# EAGLE schematic Project-PowerSwitch001 (EAGLE 7.2.0)

## Sheet 1 of 3
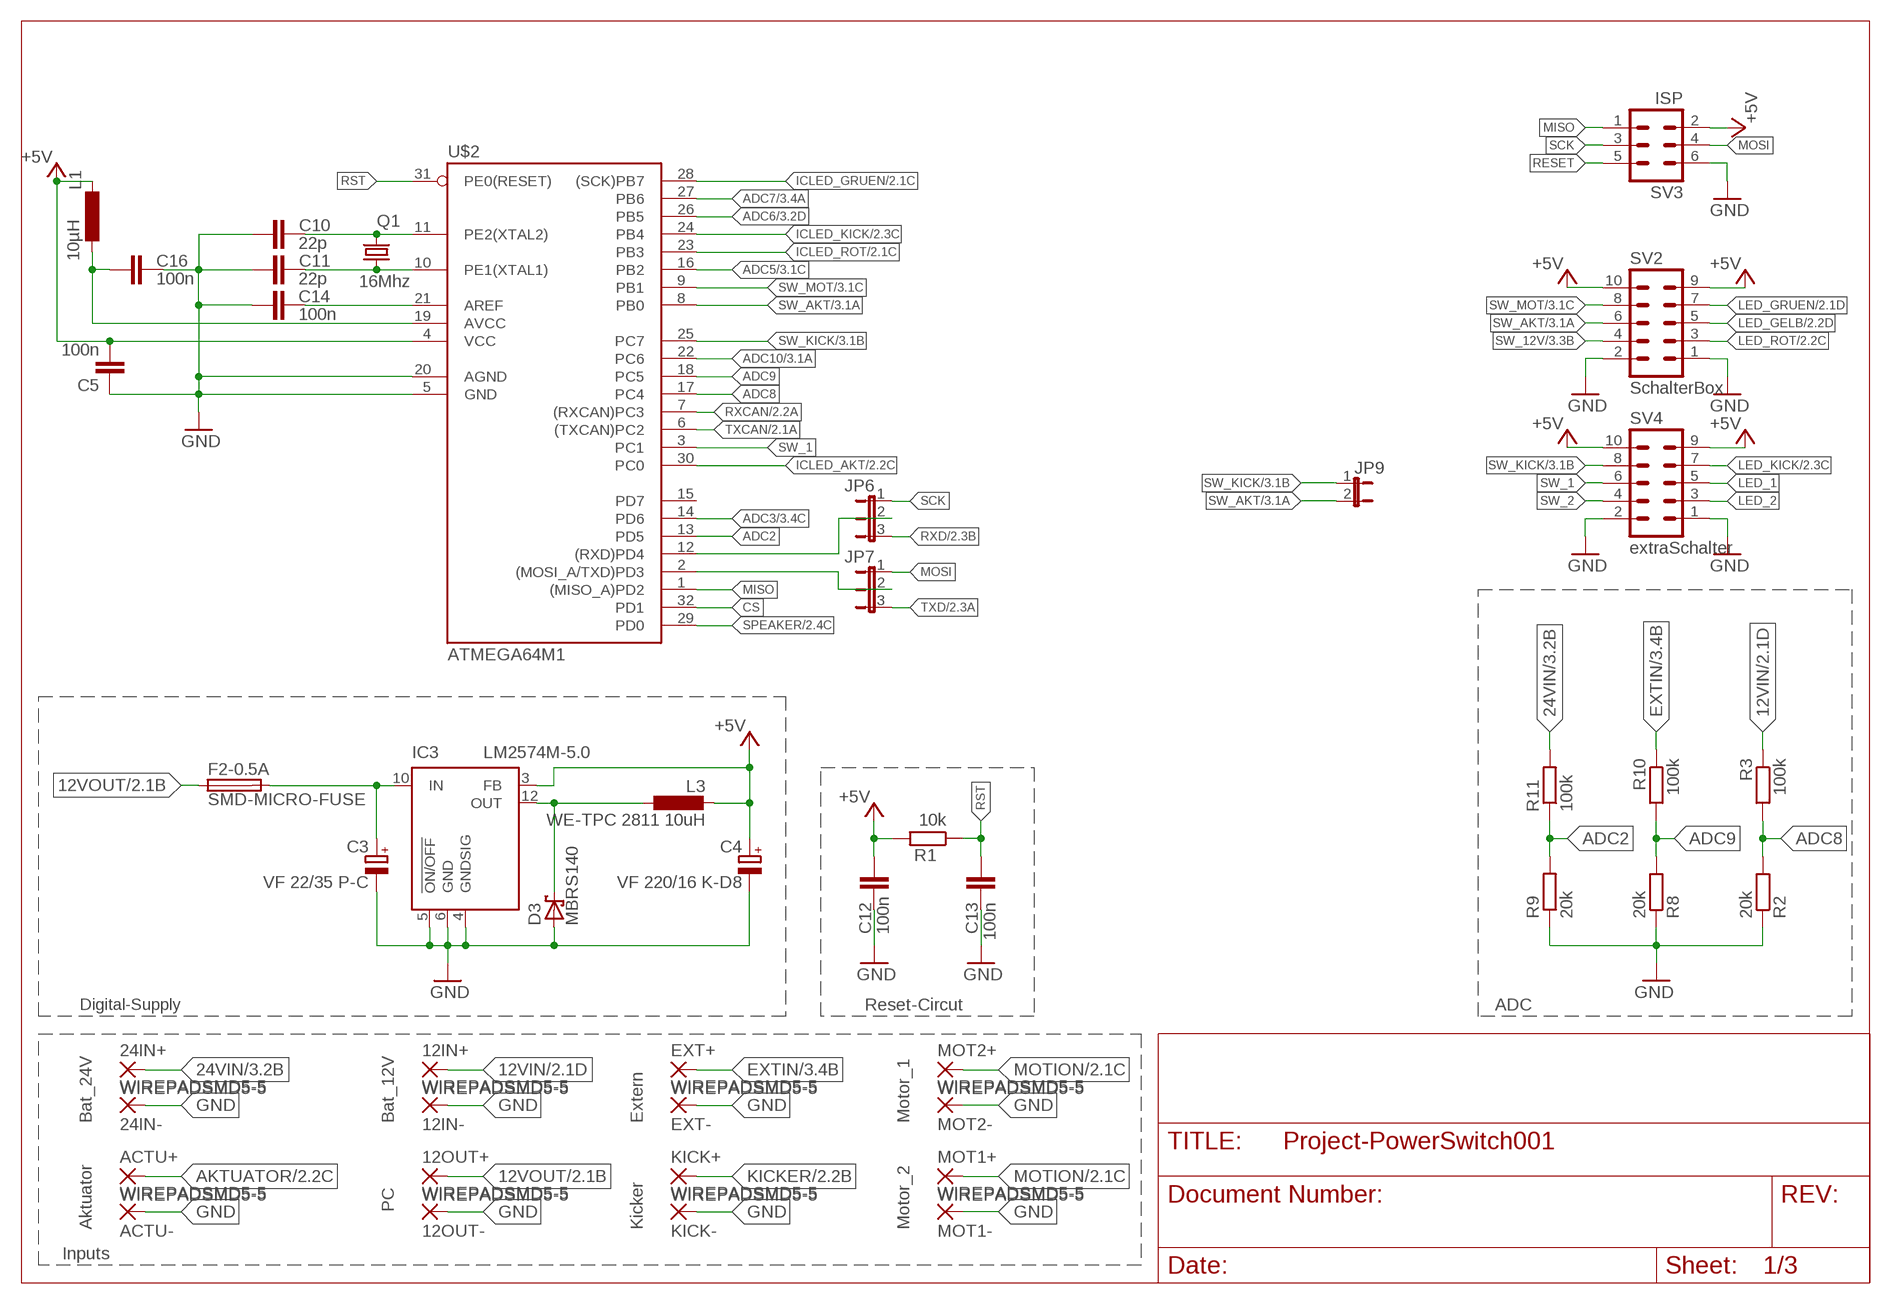
[diagram p0: schematic, sheet 1]

### Parts
12IN+  WIREPADSMD5-5  [5-5]
12IN-  WIREPADSMD5-5  [5-5]
12OUT+  WIREPADSMD5-5  [5-5]
12OUT-  WIREPADSMD5-5  [5-5]
24IN+  WIREPADSMD5-5  [5-5]
24IN-  WIREPADSMD5-5  [5-5]
ACTU+  WIREPADSMD5-5  [5-5]
ACTU-  WIREPADSMD5-5  [5-5]
C3  VF 22/35 P-C  CPOL-EUC  [PANASONIC_C]
C4  VF 220/16 K-D8  CPOL-EUD  [PANASONIC_D]
C5  100n  C-EUC0603K  [C0603K]
C10  22p  C-EUC0603K  [C0603K]
C11  22p  C-EUC0603K  [C0603K]
C12  100n  C-EUC0603K  [C0603K]
C13  100n  C-EUC0603K  [C0603K]
C14  100n  C-EUC0603K  [C0603K]
C16  100n  C-EUC0603K  [C0603K]
D3  MBRS140  SCHOTTKY-DIODESMD  [SMB]
EXT+  WIREPADSMD5-5  [5-5]
EXT-  WIREPADSMD5-5  [5-5]
F2-0.5A  SMD-MICRO-FUSE  [SMD-6,1X2,6]
IC3  LM2574M-5.0  [SO14W]
JP6  JP2E  [JP2]
JP7  JP2E  [JP2]
JP9  JP1E  [JP1]
KICK+  WIREPADSMD5-5  [5-5]
KICK-  WIREPADSMD5-5  [5-5]
L1  10µH  L-EU-0805L0805  [R0805]
L3  WE-TPC 2811 10uH  L-EUWE-TPC  [POWER-CHOKE_WE-TPC]
MOT1+  WIREPADSMD5-5  [5-5]
MOT1-  WIREPADSMD5-5  [5-5]
MOT2+  WIREPADSMD5-5  [5-5]
MOT2-  WIREPADSMD5-5  [5-5]
Q1  16Mhz  CRYTALHC49U-V  [HC49U-V@1]
R1  10k  R-EU_R0805  [R0805]
R2  20k  R-EU_R0805  [R0805]
R3  100k  R-EU_R0805  [R0805]
R8  20k  R-EU_R0805  [R0805]
R9  20k  R-EU_R0805  [R0805]
R10  100k  R-EU_R0805  [R0805]
R11  100k  R-EU_R0805  [R0805]
SV2  SchalterBox  ML10  [ML10]
SV3  ISP  ML6  [ML6]
SV4  extraSchalter  ML10  [ML10]
U$2  ATMEGA64M1  [TQFP32-08]

### Nets
12VIN: 12IN+.P$1(P) R3.1 ; also sheet 2,3
12VOUT: 12OUT+.P$1(P) F2-0.5A.1 ; also sheet 2,3
24VIN: 24IN+.P$1(P) R11.2 ; also sheet 3
+5V: C4.+ C5.2 C12.2 IC3.3(FB) L1.2 L3.2 R1.2 SV2.9 SV2.10 SV3.2 SV4.9 SV4.10 U$2.4(VCC) ; also sheet 2
ADC2: R9.2 R11.1 U$2.13(PD5)
ADC3: U$2.14(PD6) ; also sheet 3
ADC5: U$2.16(PB2) ; also sheet 3
ADC6: U$2.26(PB5) ; also sheet 3
ADC7: U$2.27(PB6) ; also sheet 3
ADC8: R2.2 R3.2 U$2.17(PC4)
ADC9: R8.2 R10.2 U$2.18(PC5)
ADC10: U$2.22(PC6) ; also sheet 3
AKTUATOR: ACTU+.P$1(P) ; also sheet 2,3
CS: U$2.32(PD1)
EXTIN: EXT+.P$1(P) R10.1 ; also sheet 3
GND: 12IN-.P$1(P) 12OUT-.P$1(P) 24IN-.P$1(P) ACTU-.P$1(P) C3.- C4.- C5.1 C10.1 C11.1 C12.1 C13.1 C14.1 C16.2 D3.A EXT-.P$1(P) IC3.4(GNDSIG) IC3.5(!ON/OFF) IC3.6(GND) KICK-.P$1(P) MOT1-.P$1(P) MOT2-.P$1(P) R2.1 R8.1 R9.1 SV2.1 SV2.2 SV3.6 SV4.1 SV4.2 U$2.5(GND) U$2.20(AGND) ; also sheet 2,3
ICLED_AKT: U$2.30(PC0) ; also sheet 2
ICLED_GRUEN: U$2.28((SCK)PB7) ; also sheet 2
ICLED_KICK: U$2.24(PB4) ; also sheet 2
ICLED_ROT: U$2.23(PB3) ; also sheet 2
KICKER: KICK+.P$1(P) ; also sheet 2,3
LED_1: SV4.5
LED_2: SV4.3
LED_GELB: SV2.5 ; also sheet 2
LED_GRUEN: SV2.7 ; also sheet 2
LED_KICK: SV4.7 ; also sheet 2
LED_ROT: SV2.3 ; also sheet 2
MISO: SV3.1 U$2.1((MISO_A)PD2)
MOSI: JP7.1 SV3.4
MOTION: MOT1+.P$1(P) MOT2+.P$1(P) ; also sheet 2,3
N$10: C10.2 Q1.2 U$2.11(PE2(XTAL2))
N$11: C11.2 Q1.1 U$2.10(PE1(XTAL1))
N$13: C14.2 U$2.21(AREF)
N$14: C16.1 L1.1 U$2.19(AVCC)
N$16: JP6.2 U$2.12((RXD)PD4)
N$17: JP7.2 U$2.2((MOSI_A/TXD)PD3)
N$22: C3.+ F2-0.5A.2 IC3.10(IN)
N$64: D3.C IC3.12(OUT) L3.1
RESET: SV3.5
RST: C13.2 R1.1 U$2.31(PE0(RESET))
RXCAN: U$2.7((RXCAN)PC3) ; also sheet 2
RXD: JP6.3 ; also sheet 2
SCK: JP6.1 SV3.3
SPEAKER: U$2.29(PD0) ; also sheet 2
SW_1: SV4.6 U$2.3(PC1)
SW_2: SV4.4
SW_12V: SV2.4 ; also sheet 3
SW_AKT: JP9.2 SV2.6 U$2.8(PB0) ; also sheet 3
SW_KICK: JP9.1 SV4.8 U$2.25(PC7) ; also sheet 3
SW_MOT: SV2.8 U$2.9(PB1) ; also sheet 3
TXCAN: U$2.6((TXCAN)PC2) ; also sheet 2
TXD: JP7.3 ; also sheet 2
Unconnected: U$2.15(PD7)

### Notes on the sheet
- Digital-Supply | Reset-Circut | ADC
- Bat_24V | Bat_12V | Extern | Motor_1
- PC
- Aktuator | Kicker | Motor_2
- Inputs

## Sheet 2 of 3
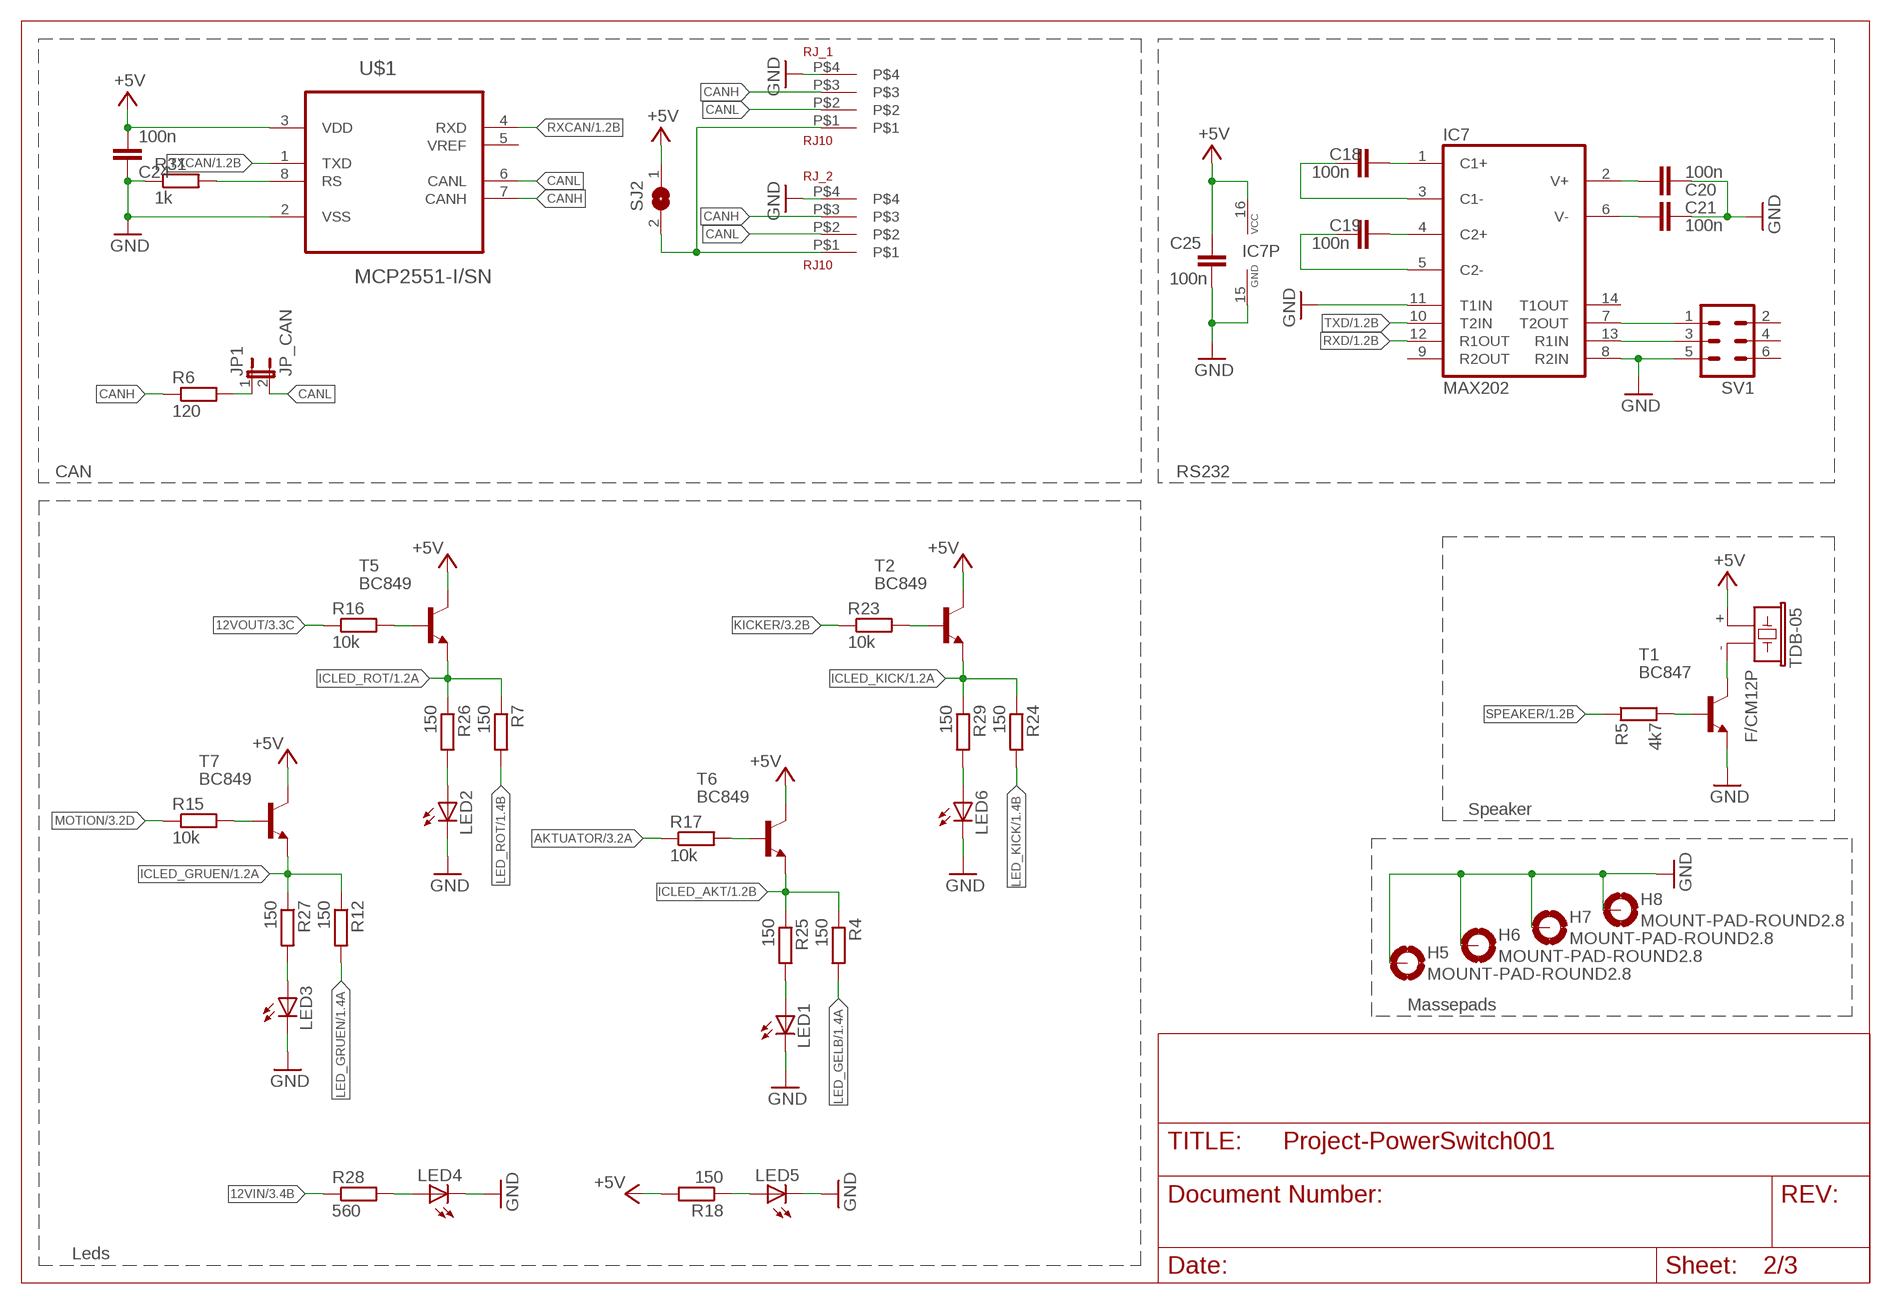
[diagram p1: schematic, sheet 2]

### Parts
C18  100n  C-EUC0603K  [C0603K]
C19  100n  C-EUC0603K  [C0603K]
C20  100n  C-EUC0603K  [C0603K]
C21  100n  C-EUC0603K  [C0603K]
C24  100n  C-EUC0603  [C0603]
C25  100n  C-EUC0603K  [C0603K]
H5  MOUNT-PAD-ROUND2.8  [2,8-PAD]
H6  MOUNT-PAD-ROUND2.8  [2,8-PAD]
H7  MOUNT-PAD-ROUND2.8  [2,8-PAD]
H8  MOUNT-PAD-ROUND2.8  [2,8-PAD]
IC7  MAX202  MAX3232CSE  [SO16]
JP1  JP_CAN  JP1E  [JP1]
LED1  LEDCHIPLED_0805  [CHIPLED_0805]
LED2  LEDCHIPLED_0805  [CHIPLED_0805]
LED3  LEDCHIPLED_0805  [CHIPLED_0805]
LED4  LEDCHIPLED_0805  [CHIPLED_0805]
LED5  LEDCHIPLED_0805  [CHIPLED_0805]
LED6  LEDCHIPLED_0805  [CHIPLED_0805]
R4  150  R-EU_R0805  [R0805]
R5  4k7  R-EU_R0805  [R0805]
R6  120  R-EU_M0805  [M0805]
R7  150  R-EU_R0805  [R0805]
R12  150  R-EU_R0805  [R0805]
R15  10k  R-EU_R0805  [R0805]
R16  10k  R-EU_R0805  [R0805]
R17  10k  R-EU_R0805  [R0805]
R18  150  R-EU_R0805  [R0805]
R23  10k  R-EU_R0805  [R0805]
R24  150  R-EU_R0805  [R0805]
R25  150  R-EU_R0805  [R0805]
R26  150  R-EU_R0805  [R0805]
R27  150  R-EU_R0805  [R0805]
R28  560  R-EU_R0805  [R0805]
R29  150  R-EU_R0805  [R0805]
R31  1k  R-EU_R0805  [R0805]
RJ_1  RJ10  [RJ10]
RJ_2  RJ10  [RJ10]
SJ2  SJ  [SJ]
SV1  ML6  [ML6]
T1  BC847  [SOT23]
T2  BC849  [SOT23]
T5  BC849  [SOT23]
T6  BC849  [SOT23]
T7  BC849  [SOT23]
TDB-05  F/CM12P  [F/CM12P]
U$1  MCP2551-I/SN  [SOIC127P600X175-8N]

### Nets
12VIN: R28.1 ; also sheet 1,3
12VOUT: R16.1 ; also sheet 1,3
+5V: C24.2 C25.1 IC7.16(VCC) R18.2 SJ2.1 T2.3(C) T5.3(C) T6.3(C) T7.3(C) TDB-05.+ U$1.3(VDD) ; also sheet 1
AKTUATOR: R17.1 ; also sheet 1,3
CANH: R6.1 RJ_1.P$3 RJ_2.P$3 U$1.7(CANH)
CANL: JP1.2 RJ_1.P$2 RJ_2.P$2 U$1.6(CANL)
GND: C20.2 C21.2 C24.1 C25.2 H5.B2,8(MOUNT) H6.B2,8(MOUNT) H7.B2,8(MOUNT) H8.B2,8(MOUNT) IC7.8(R2IN) IC7.11(T1IN) IC7.15(GND) LED1.C LED2.C LED3.C LED4.C LED5.C LED6.C R31.1 RJ_1.P$4 RJ_2.P$4 SV1.5 T1.2(E) U$1.2(VSS) ; also sheet 1,3
ICLED_AKT: R4.1 R25.1 T6.2(E) ; also sheet 1
ICLED_GRUEN: R12.1 R27.1 T7.2(E) ; also sheet 1
ICLED_KICK: R24.1 R29.1 T2.2(E) ; also sheet 1
ICLED_ROT: R7.1 R26.1 T5.2(E) ; also sheet 1
KICKER: R23.1 ; also sheet 1,3
LED_GELB: R4.2 ; also sheet 1
LED_GRUEN: R12.2 ; also sheet 1
LED_KICK: R24.2 ; also sheet 1
LED_ROT: R7.2 ; also sheet 1
MOTION: R15.1 ; also sheet 1,3
N$1: R5.2 T1.1(B)
N$2: RJ_1.P$1 RJ_2.P$1 SJ2.2
N$4: R23.2 T2.1(B)
N$5: LED6.A R29.2
N$6: R31.2 U$1.8(RS)
N$7: JP1.1 R6.2
N$8: LED1.A R25.2
N$9: LED2.A R26.2
N$15: C18.2 IC7.1(C1+)
N$18: C19.2 IC7.4(C2+)
N$20: T1.3(C) TDB-05.-
N$21: LED3.A R27.2
N$24: LED4.A R28.2
N$35: C18.1 IC7.3(C1-)
N$36: C19.1 IC7.5(C2-)
N$37: C20.1 IC7.2(V+)
N$38: C21.1 IC7.6(V-)
N$40: IC7.13(R1IN) SV1.3
N$41: IC7.7(T2OUT) SV1.1
N$102: R16.2 T5.1(B)
N$104: R17.2 T6.1(B)
N$106: R15.2 T7.1(B)
N$108: LED5.A R18.1
RXCAN: U$1.4(RXD) ; also sheet 1
RXD: IC7.12(R1OUT) ; also sheet 1
SPEAKER: R5.1 ; also sheet 1
TXCAN: U$1.1(TXD) ; also sheet 1
TXD: IC7.10(T2IN) ; also sheet 1
Unconnected: IC7.9(R2OUT) IC7.14(T1OUT) SV1.2 SV1.4 SV1.6 U$1.5(VREF)

### Notes on the sheet
- CAN | RS232
- Speaker
- Massepads
- Leds

## Sheet 3 of 3
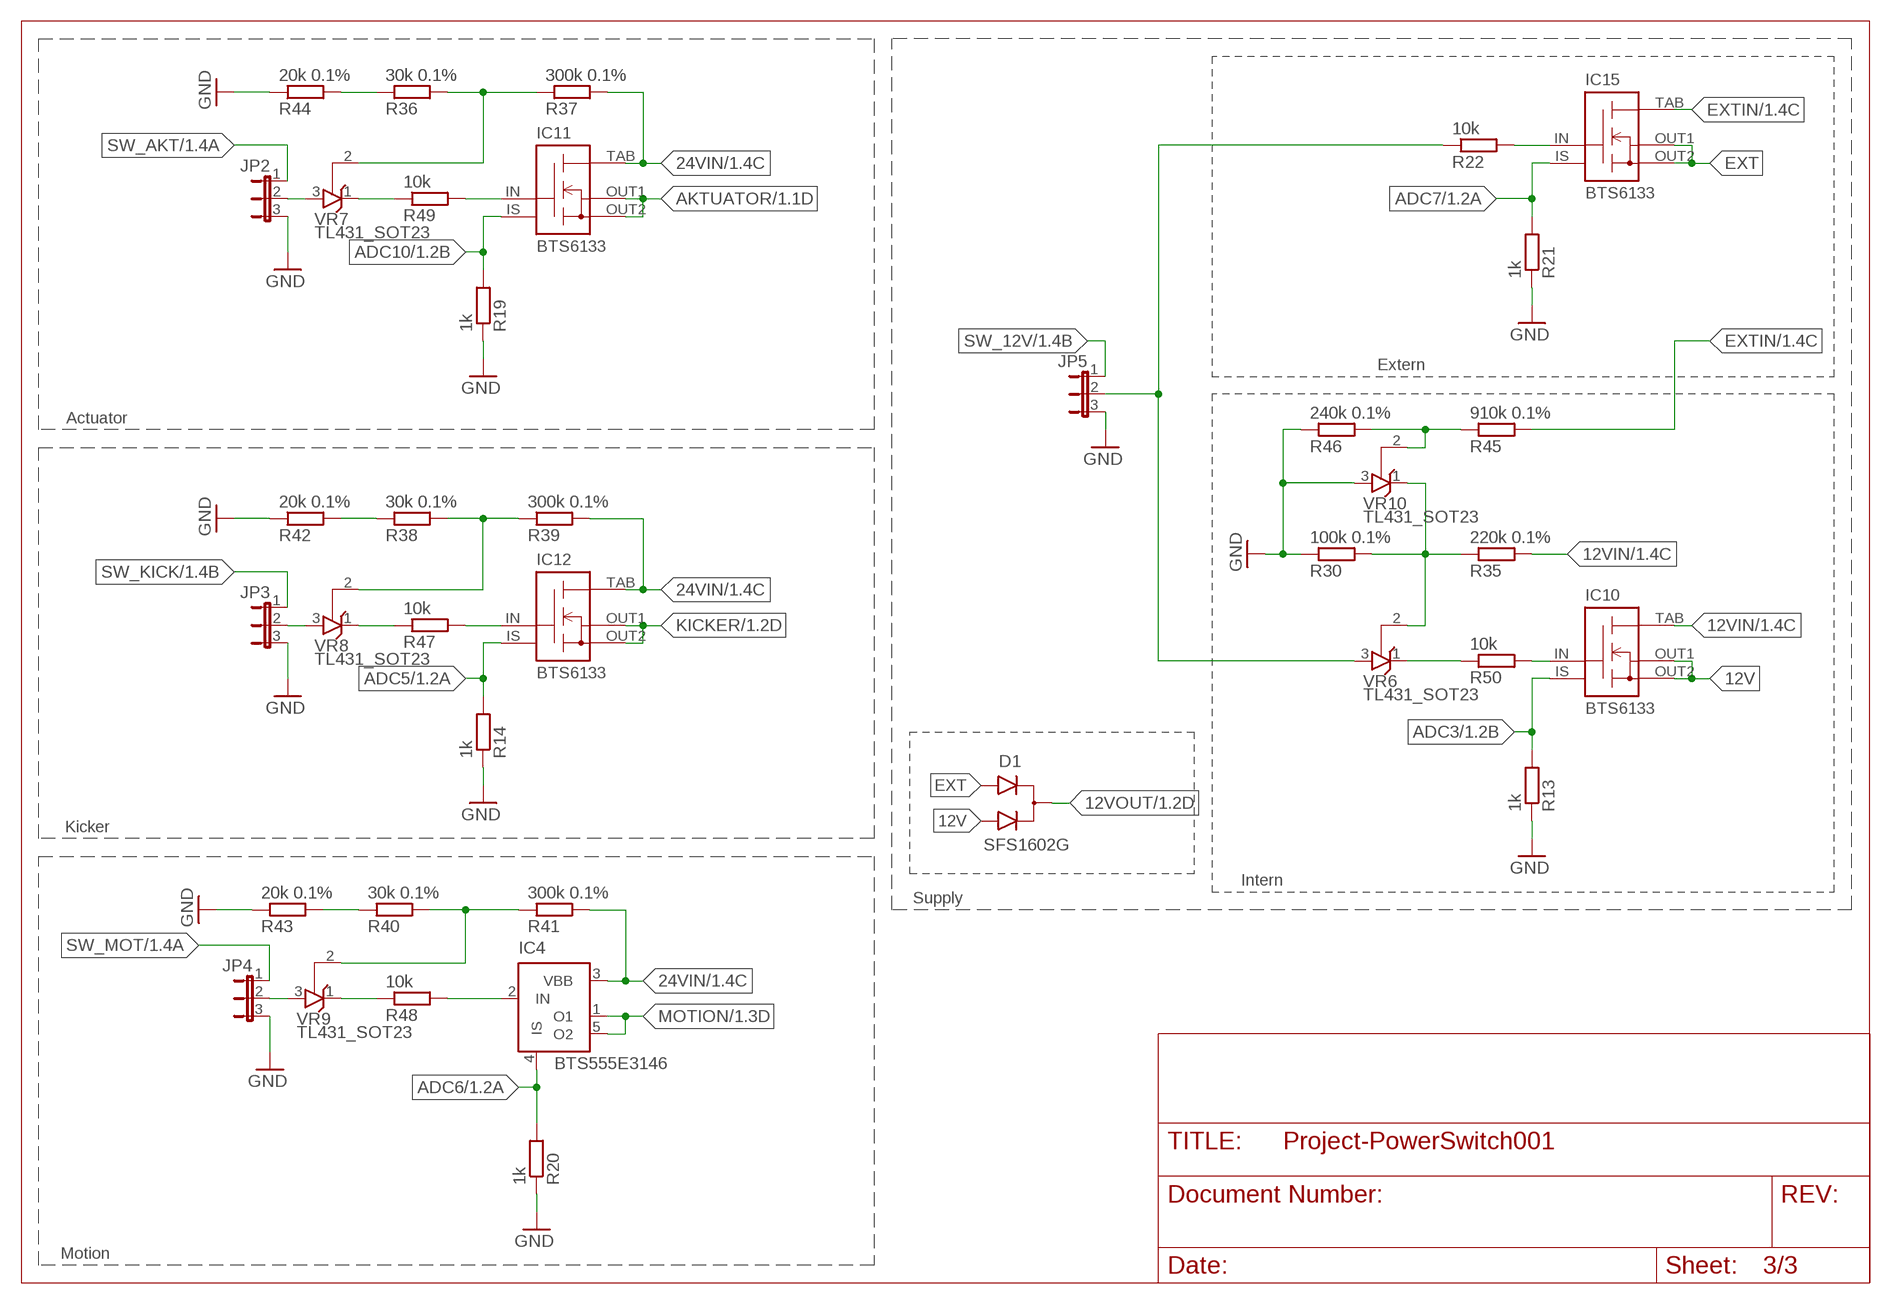
[diagram p2: schematic, sheet 3]

### Parts
D1  SFS1602G  SFS160G  [D2PAK]
IC4  BTS555E3146  [TO220-52]
IC10  BTS6133  [TO252-51]
IC11  BTS6133  [TO252-51]
IC12  BTS6133  [TO252-51]
IC15  BTS6133  [TO252-51]
JP2  JP2E  [JP2]
JP3  JP2E  [JP2]
JP4  JP2E  [JP2]
JP5  JP2E  [JP2]
R13  1k  R-EU_R0805  [R0805]
R14  1k  R-EU_R0805  [R0805]
R19  1k  R-EU_R0805  [R0805]
R20  1k  R-EU_R0805  [R0805]
R21  1k  R-EU_R0805  [R0805]
R22  10k  R-EU_R0805  [R0805]
R30  100k 0.1%  R-EU_R0805  [R0805]
R35  220k 0.1%  R-EU_R0805  [R0805]
R36  30k 0.1%  R-EU_R0805  [R0805]
R37  300k 0.1%  R-EU_R0805  [R0805]
R38  30k 0.1%  R-EU_R0805  [R0805]
R39  300k 0.1%  R-EU_R0805  [R0805]
R40  30k 0.1%  R-EU_R0805  [R0805]
R41  300k 0.1%  R-EU_R0805  [R0805]
R42  20k 0.1%  R-EU_R0805  [R0805]
R43  20k 0.1%  R-EU_R0805  [R0805]
R44  20k 0.1%  R-EU_R0805  [R0805]
R45  910k 0.1%  R-EU_R0805  [R0805]
R46  240k 0.1%  R-EU_R0805  [R0805]
R47  10k  R-EU_R0805  [R0805]
R48  10k  R-EU_R0805  [R0805]
R49  10k  R-EU_R0805  [R0805]
R50  10k  R-EU_R0805  [R0805]
VR6  TL431_SOT23  [SOT23]
VR7  TL431_SOT23  [SOT23]
VR8  TL431_SOT23  [SOT23]
VR9  TL431_SOT23  [SOT23]
VR10  TL431_SOT23  [SOT23]

### Nets
12V: D1.P$2 IC10.OUT1(OUT) IC10.OUT2(OUT)
12VIN: IC10.TAB(VBB) R35.2 ; also sheet 1,2
12VOUT: D1.P$3 ; also sheet 1,2
24VIN: IC4.3(VBB) IC11.TAB(VBB) IC12.TAB(VBB) R37.2 R39.2 R41.2 ; also sheet 1
ADC3: IC10.IS R13.2 ; also sheet 1
ADC5: IC12.IS R14.2 ; also sheet 1
ADC6: IC4.4(IS) R20.2 ; also sheet 1
ADC7: IC15.IS R21.2 ; also sheet 1
ADC10: IC11.IS R19.2 ; also sheet 1
AKTUATOR: IC11.OUT1(OUT) IC11.OUT2(OUT) ; also sheet 1,2
EXT: D1.P$1 IC15.OUT1(OUT) IC15.OUT2(OUT)
EXTIN: IC15.TAB(VBB) R45.2 ; also sheet 1
GND: JP2.3 JP3.3 JP4.3 JP5.3 R13.1 R14.1 R19.1 R20.1 R21.1 R30.1 R42.1 R43.1 R44.1 R46.1 VR10.3(A) ; also sheet 1,2
KICKER: IC12.OUT1(OUT) IC12.OUT2(OUT) ; also sheet 1,2
MOTION: IC4.1(O1) IC4.5(O2) ; also sheet 1,2
N$3: IC15.IN R22.2
N$12: JP2.2 VR7.3(A)
N$19: JP4.2 VR9.3(A)
N$23: JP3.2 VR8.3(A)
N$25: JP5.2 R22.1 VR6.3(A)
N$28: IC10.IN R50.2
N$33: R30.2 R35.1 VR6.2(R) VR10.1(C)
N$39: R49.1 VR7.1(C)
N$42: R36.2 R37.1 VR7.2(R)
N$43: IC12.IN R47.2
N$44: R38.2 R39.1 VR8.2(R)
N$45: R40.2 R41.1 VR9.2(R)
N$46: IC4.2(IN) R48.2
N$47: R38.1 R42.2
N$48: R40.1 R43.2
N$49: R36.1 R44.2
N$50: R45.1 R46.2 VR10.2(R)
N$51: R47.1 VR8.1(C)
N$52: R48.1 VR9.1(C)
N$53: IC11.IN R49.2
N$54: R50.1 VR6.1(C)
SW_12V: JP5.1 ; also sheet 1
SW_AKT: JP2.1 ; also sheet 1
SW_KICK: JP3.1 ; also sheet 1
SW_MOT: JP4.1 ; also sheet 1

### Notes on the sheet
- Extern
- Actuator
- Kicker
- Intern
- Supply
- Motion

## Library data of the parts
12IN+ 12IN- 12OUT+ 12OUT- 24IN+ 24IN- ACTU+ ACTU- EXT+ EXT- KICK+ KICK- MOT1+ MOT1- MOT2+ MOT2- = mywirepad:WIREPAD: Wire PAD connect wire on PCB
C3 C4 = rcl:CPOL-EU: POLARIZED CAPACITOR, European symbol
C5 C10-C14 C16 C18-C21 C24 C25 = rcl:C-EU: CAPACITOR, European symbol
D1 = ownParts:SFS160*G
D3 = diode:SCHOTTKY-DIODE: Schottky Diode
F2-0.5A = f-lf-omniblok-s:SMD-MICRO-FUSE
H5-H8 = holes:MOUNT-PAD-ROUND: MOUNTING PAD, round
IC3 = linear:LM2574?-*: SIMPLE SWITCHER 0.5A Step-Down Voltage Regulator Source: http://cache.national.com/ds/LM/LM2574.pdf
IC4 = infineon:BTS555: PROFET® Data Sheet BTS555 Source: http://www.infineon.com/upload/Document/cmc_upload/documents/011/8726/Datasheet_BTS555.pdf; OC_FARNELL: unknown; OC_NEWARK: unknown
IC7 = maxim:MAX3232*: True RS-232 Transceivers 3.0V to 5.5V, Low-Power up to 1Mbps, Using Four 0.1µF External Capacitors Source: http://pdfserv.maxim-ic.com/en/ds/MAX3222-MAX3241.pdf; MPN: MAX3232CSE; OC_FARNELL: 9725490; OC_NEWARK: 90C2890
IC10-IC12 IC15 = BTS443P:BTS6133
JP1 JP9 = jumper:JP1E: JUMPER
JP2-JP7 = jumper:JP2E: JUMPER
L1 = myrcl:L-EU-0805
L3 = rcl:L-EU: INDUCTOR, European symbol
LED1-LED6 = led:LED: LED OSRAM: - CHIPLED LG R971, LG N971, LY N971, LG Q971, LY Q971, LO R971, LY R971 LH N974, LH R974 LS Q976, LO Q976, LY Q976 LO Q996 - Hyper CHIPLED LW Q18S LB Q993, LB Q99A, LB R99A - SideLED LS A670, LO A670, LY A670, LG A670, LP A670 LB A673, LV A673, LT A673, LW A673 LH A674 LY A675 LS A676, LA A676, LO A676, LY A676, LW A676 LS A679, LY A679, LG A679 - Hyper Micro SIDELED® LS Y876, LA Y876, LO Y876, LY Y876 LT Y87S - SmartLED LW L88C, LW L88S LB L89C, LB L89S, LG L890 LS L89K, LO L89K, LY L89K LS L896, LA L896, LO L896, LY L896 - TOPLED LS T670, LO T670, LY T670, LG T670, LP T670 LSG T670, LSP T670, LSY T670, LOP T670, LYG T670 LG T671, LOG T671, LSG T671 LB T673, LV T673, LT T673, LW T673 LH T674 LS T676, LA T676, LO T676, LY T676, LB T676, LH T676, LSB T676, LW T676 LB T67C, LV T67C, LT T67C, LS T67K, LO T67K, LY T67K, LW E67C LS E67B, LA E67B, LO E67B, LY E67B, LB E67C, LV E67C, LT E67C LW T67C LS T679, LY T679, LG T679 LS T770, LO T770, LY T770, LG T770, LP T770 LB T773, LV T773, LT T773, LW T773 LH T774 LS E675, LA E675, LY E675, LS T675 LS T776, LA T776, LO T776, LY T776, LB T776 LHGB T686 LT T68C, LB T68C - Hyper Mini TOPLED® LB M676 - Mini TOPLED Santana® LG M470 LS M47K, LO M47K, LY M47K Source: http://www.osram.convergy.de LUXEON: - LUMILED® LXK2-PW12-R00, LXK2-PW12-S00, LXK2-PW14-U00, LXK2-PW14-V00 LXK2-PM12-R00, LXK2-PM12-S00, LXK2-PM14-U00 LXK2-PE12-Q00, LXK2-PE12-R00, LXK2-PE12-S00, LXK2-PE14-T00, LXK2-PE14-U00 LXK2-PB12-K00, LXK2-PB12-L00, LXK2-PB12-M00, LXK2-PB14-N00, LXK2-PB14-P00, LXK2-PB14-Q00 LXK2-PR12-L00, LXK2-PR12-M00, LXK2-PR14-Q00, LXK2-PR14-R00 LXK2-PD12-Q00, LXK2-PD12-R00, LXK2-PD12-S00 LXK2-PH12-R00, LXK2-PH12-S00 LXK2-PL12-P00, LXK2-PL12-Q00, LXK2-PL12-R00 Source: www.luxeon.com KINGBRIGHT: KA-3528ASYC Source: www.kingbright.com
Q1 = crystal:CRYTAL: CRYSTAL
R1-R31 R35-R50 = rcl:R-EU_: RESISTOR, European symbol
RJ_1 RJ_2 = ownParts:RJ10
SJ2 = jumper:SJ: SMD solder JUMPER
SV1 SV3 = con-ml:ML6: HARTING; OC_FARNELL: unknown; OC_NEWARK: unknown
SV2 SV4 = con-ml:ML10: HARTING; OC_FARNELL: unknown; OC_NEWARK: unknown
T1 = transistor:BC847: NPN TRANSISTOR
T2 T5-T7 = transistor:BC849: NPN TRANSISTOR
TDB-05 = buzzer:F/CM12P: BUZZER Source: Buerklin; OC_FARNELL: unknown; OC_NEWARK: unknown
U$1 = Microchip-MCP2551-I_SN:MCP2551-I/SN: High-Speed CAN Transceiver; MPN: MCP2551-I/SN; OC_FARNELL: 9758569; OC_NEWARK: 69K7604; PACKAGE: SOIC-8; SUPPLIER: Microchip
U$2 = atmega16m1-32m1-64m1:ATMEGA64M1
VR6-VR10 = 1_USER:TL431